# Altium schematic sheet Sheet1.SchDoc
size A; Address1: chien nguyen
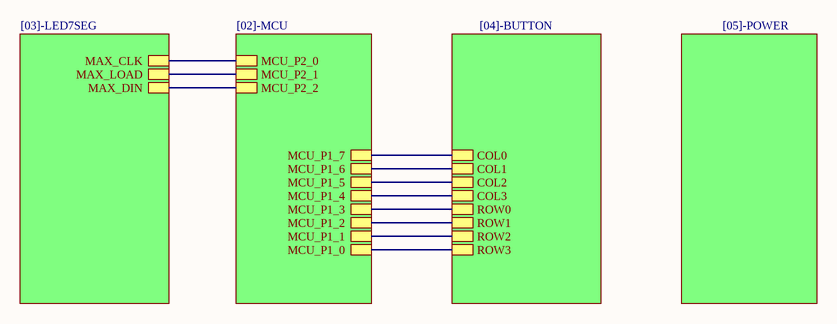
[diagram p0: Sheet1.SchDoc]

## Sub-sheets
0 = [03]-LED7SEG: MAX_DIN, MAX_CLK, MAX_LOAD
1 = [02]-MCU: MCU_P1_5, MCU_P1_6, MCU_P1_2, MCU_P1_7, MCU_P1_3, MCU_P1_4, MCU_P1_1, MCU_P1_0, MCU_P2_0, MCU_P2_1, MCU_P2_2
2 = [04]-BUTTON: ROW0, ROW1, ROW2, ROW3, COL0, COL1, COL2, COL3
3 = [05]-POWER: no entries

## Nets
(unnamed): sheet 1/MCU_P1_5, sheet 2/COL2
(unnamed): sheet 1/MCU_P1_6, sheet 2/COL1
(unnamed): sheet 1/MCU_P1_2, sheet 2/ROW1
(unnamed): sheet 1/MCU_P1_7, sheet 2/COL0
(unnamed): sheet 1/MCU_P1_3, sheet 2/ROW0
(unnamed): sheet 1/MCU_P1_4, sheet 2/COL3
(unnamed): sheet 1/MCU_P1_1, sheet 2/ROW2
(unnamed): sheet 1/MCU_P1_0, sheet 2/ROW3
(unnamed): sheet 1/MCU_P2_0, sheet 0/MAX_CLK
(unnamed): sheet 1/MCU_P2_1, sheet 0/MAX_LOAD
(unnamed): sheet 1/MCU_P2_2, sheet 0/MAX_DIN